# Altium schematic sheet CM0 Controller.SchDoc
size A
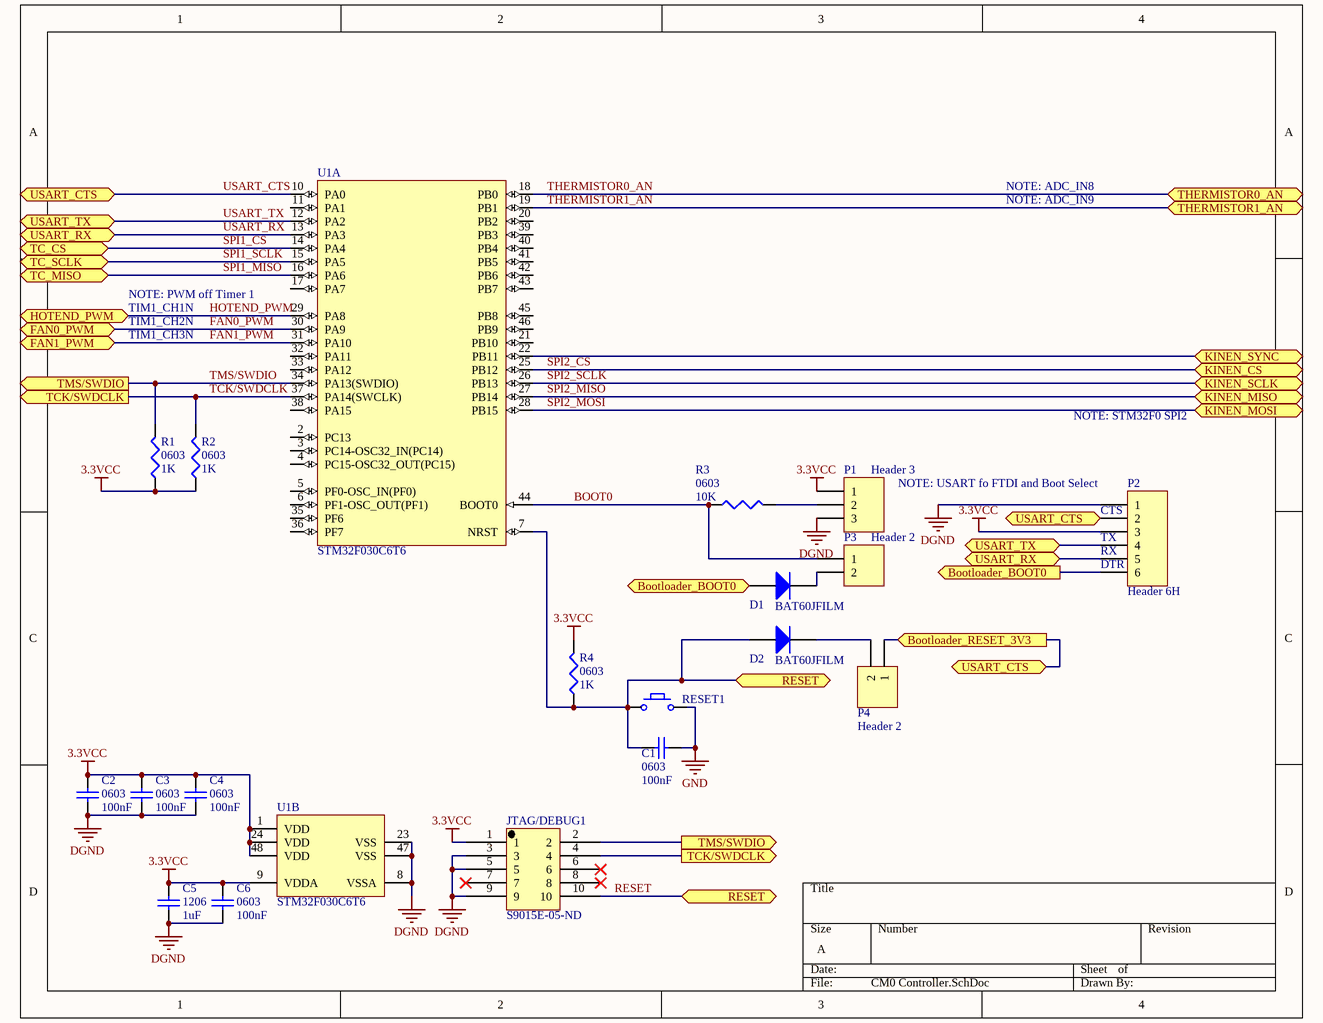
[diagram p0: CM0 Controller.SchDoc]

## Parts
C1  0603  value 100nF  [1608[0603]]
C2  0603  value 100nF  [1608[0603]]
C3  0603  value 100nF  [1608[0603]]
C4  0603  value 100nF  [1608[0603]]
C5  1206  value 1uF  [C1206]
C6  0603  value 100nF  [1608[0603]]
D1  BAT60JFILM  [SOD-323]
D2  BAT60JFILM  [SOD-323]
JTAG/DEBUG1  S9015E-05-ND  [S9015E-05-ND]
P1  Header 3  [HDR1X3]
P2  Header 6H  [HDR1X6H]
P3  Header 2  [HDR1X2]
P4  Header 2  [HDR1X2]
R1  0603  value 1K  [J1-0603]
R2  0603  value 1K  [J1-0603]
R3  0603  value 10K  [J1-0603]
R4  0603  value 1K  [J1-0603]
RESET1  Tactile Switch  [tactile switch]  (value not drawn)
U1  STM32F030C6T6  [STM-LQFP48_L]  (parts A,B of 2)

## Ports
Bootloader_BOOT0 (in), Bootloader_BOOT0 (out), Bootloader_RESET_3V3 (in), FAN0_PWM, FAN1_PWM, HOTEND_PWM, KINEN_CS, KINEN_MISO, KINEN_MOSI, KINEN_SCLK, KINEN_SYNC, RESET (bidir), TC_CS, TC_MISO, TC_SCLK, TCK/SWDCLK (out), THERMISTOR0_AN, THERMISTOR1_AN, TMS/SWDIO (out), USART_CTS, USART_RX, USART_TX

## Nets
3.3VCC: C2.2 C3.2 C4.2 C5.1 C6.1 JTAG/DEBUG1.1 P1.1 P2.3 R1.1 R2.1 R4.2 U1.1(VDD) U1.9(VDDA) U1.24(VDD) U1.48(VDD)
DGND: C2.1 C3.1 C4.1 C5.2 C6.2 JTAG/DEBUG1.3 JTAG/DEBUG1.5 JTAG/DEBUG1.9 P1.3 P2.1 U1.8(VSSA) U1.23(VSS) U1.47(VSS)
GND: C1.1 RESET1.2
BOOT0: P3.1 R3.1 U1.44(BOOT0)
Bootloader_BOOT0: D1.1(A) P2.6 ; port Bootloader_BOOT0
FAN0_PWM: U1.30(PA9) ; port FAN0_PWM
FAN1_PWM: U1.31(PA10) ; port FAN1_PWM
HOTEND_PWM: U1.29(PA8) ; port HOTEND_PWM
KINEN_SYNC: U1.22(PB11) ; port KINEN_SYNC
RESET: C1.2 D2.1(A) JTAG/DEBUG1.10 R4.1 RESET1.1 U1.7(NRST) ; port RESET
SPI1_CS: U1.14(PA4) ; port TC_CS
SPI1_MISO: U1.16(PA6) ; port TC_MISO
SPI1_SCLK: U1.15(PA5) ; port TC_SCLK
SPI2_CS: U1.25(PB12) ; port KINEN_CS
SPI2_MISO: U1.27(PB14) ; port KINEN_MISO
SPI2_MOSI: U1.28(PB15) ; port KINEN_MOSI
SPI2_SCLK: U1.26(PB13) ; port KINEN_SCLK
TCK/SWDCLK: JTAG/DEBUG1.4 R2.2 U1.37(PA14(SWCLK)) ; port TCK/SWDCLK
THERMISTOR0_AN: U1.18(PB0) ; port THERMISTOR0_AN
THERMISTOR1_AN: U1.19(PB1) ; port THERMISTOR1_AN
TMS/SWDIO: JTAG/DEBUG1.2 R1.2 U1.34(PA13(SWDIO)) ; port TMS/SWDIO
USART_CTS: P2.2 P4.1 U1.10(PA0) ; port Bootloader_RESET_3V3, port USART_CTS
USART_RX: P2.5 U1.13(PA3) ; port USART_RX
USART_TX: P2.4 U1.12(PA2) ; port USART_TX
NetD1_2: D1.2(K) P3.2
NetD2_2: D2.2(K) P4.2
NetP1_2: P1.2 R3.2

Not connected (* = marked no-connect by the designer): JTAG/DEBUG1 6* 7* 8*; U1 2(PC13) 3(PC14-OSC32_IN(PC14)) 4(PC15-OSC32_OUT(PC15)) 5(PF0-OSC_IN(PF0)) 6(PF1-OSC_OUT(PF1)) 11(PA1) 17(PA7) 20(PB2) 21(PB10) 32(PA11) 33(PA12) 35(PF6) 36(PF7) 38(PA15) 39(PB3) 40(PB4) 41(PB5) 42(PB6) 43(PB7) 45(PB8) 46(PB9)

## Notes on the sheet
- NOTE: ADC_IN8
- NOTE: ADC_IN9
- NOTE: PWM off Timer 1
- TIM1_CH2N
- TIM1_CH3N
- TIM1_CH1N
- NOTE: STM32F0 SPI2
- (near P2) NOTE: USART fo FTDI and Boot Select
- (near P2) DTR
- (near P2) RX
- (near P2) TX
- (near P2) CTS

## Library data of the parts
C1-C6 = Cap Semi: Capacitor (Semiconductor SIM Model); Published: 8-Jun-2000; LatestRevisionDate: 29-May-2009; LatestRevisionNote: IPC-7351 Footprint Added.; PackageReference: C1206; Publisher: Altium Limited; PackageDescription: Chip Capacitor
D1 D2 = Diode: Default Diode; Code - JEDEC: DO-214-AB; Published: 8-Jun-2000; Revision: July-2002: Re-released for DXP Platform.; Publisher: Altium Limited
P1 = Header 3: Header, 3-Pin; LatestRevisionDate: 17-Jul-2002; LatestRevisionNote: Re-released for DXP Platform.; Publisher: Altium Limited
P2 = Header 6H: Header, 6-Pin, Right Angle; LatestRevisionDate: 17-Jul-2002; LatestRevisionNote: Re-released for DXP Platform.; Publisher: Altium Limited
P3 P4 = Header 2: Header, 2-Pin; LatestRevisionDate: 17-Jul-2002; LatestRevisionNote: Re-released for DXP Platform.; Publisher: Altium Limited
R1-R4 = Res3: Resistor; Published: 8-Jun-2000; LatestRevisionDate: 29-May-2009; LatestRevisionNote: IPC-7351 Footprint Added.; PackageReference: J1-0603; Publisher: Altium Limited; PackageDescription: Chip Resistor
U1 = STM32F030C6T6: ARM Cortex-M0 32-bit MCU, 32 KB Flash, 4 KB Internal RAM, 39 I/Os, 48-pin LQFP, -40 to 85 degC, Tray; FLASH Size (Prog) (kB): 32; I/Os (High Current): 39; Internal RAM Size (kB): 4; Operating Frequency(F) (Processor speed) (MHz): 48; Supply Voltage(Vcc) min (V): 2.4; DatasheetVersion: Rev. 1; PackageVersion: Rev. 6, 06/2013; PackageReference: LQFP48; PackageDescription: 48-Pin Low Profile Quad Flat Package, 7 x 7 mm Body, 0.5 mm Pitch; Supplier 1: Digi-Key; Supplier Part Number 1: 497-14042-ND; Supplier 2: Newark; Supplier Part Number 2: 06X3646; Supplier 3: Mouser; Supplier Part Number 3: 511-STM32F030C6T6; Core: ARM Cortex-M0; Packing: Tray; Mounting Technology: Surface Mount; PartNumber: STM32F030C6T6; ComponentLink1Description: Manufacturer URL; ComponentLink1URL: http://www.st.com/web/en/home.html; ComponentLink2Description: Datasheet; ComponentLink2URL: http://www.st.com/st-web-ui/static/active/en/resource/technical/document/datasheet/DM00088500.pdf; ComponentLink3Description: Package Specification; ComponentLink3URL: http://www.st.com/st-web-ui/static/active/en/resource/technical/document/datasheet/DM00058181.pdf